# EAGLE design leanerModule (EAGLE 9.6.2)
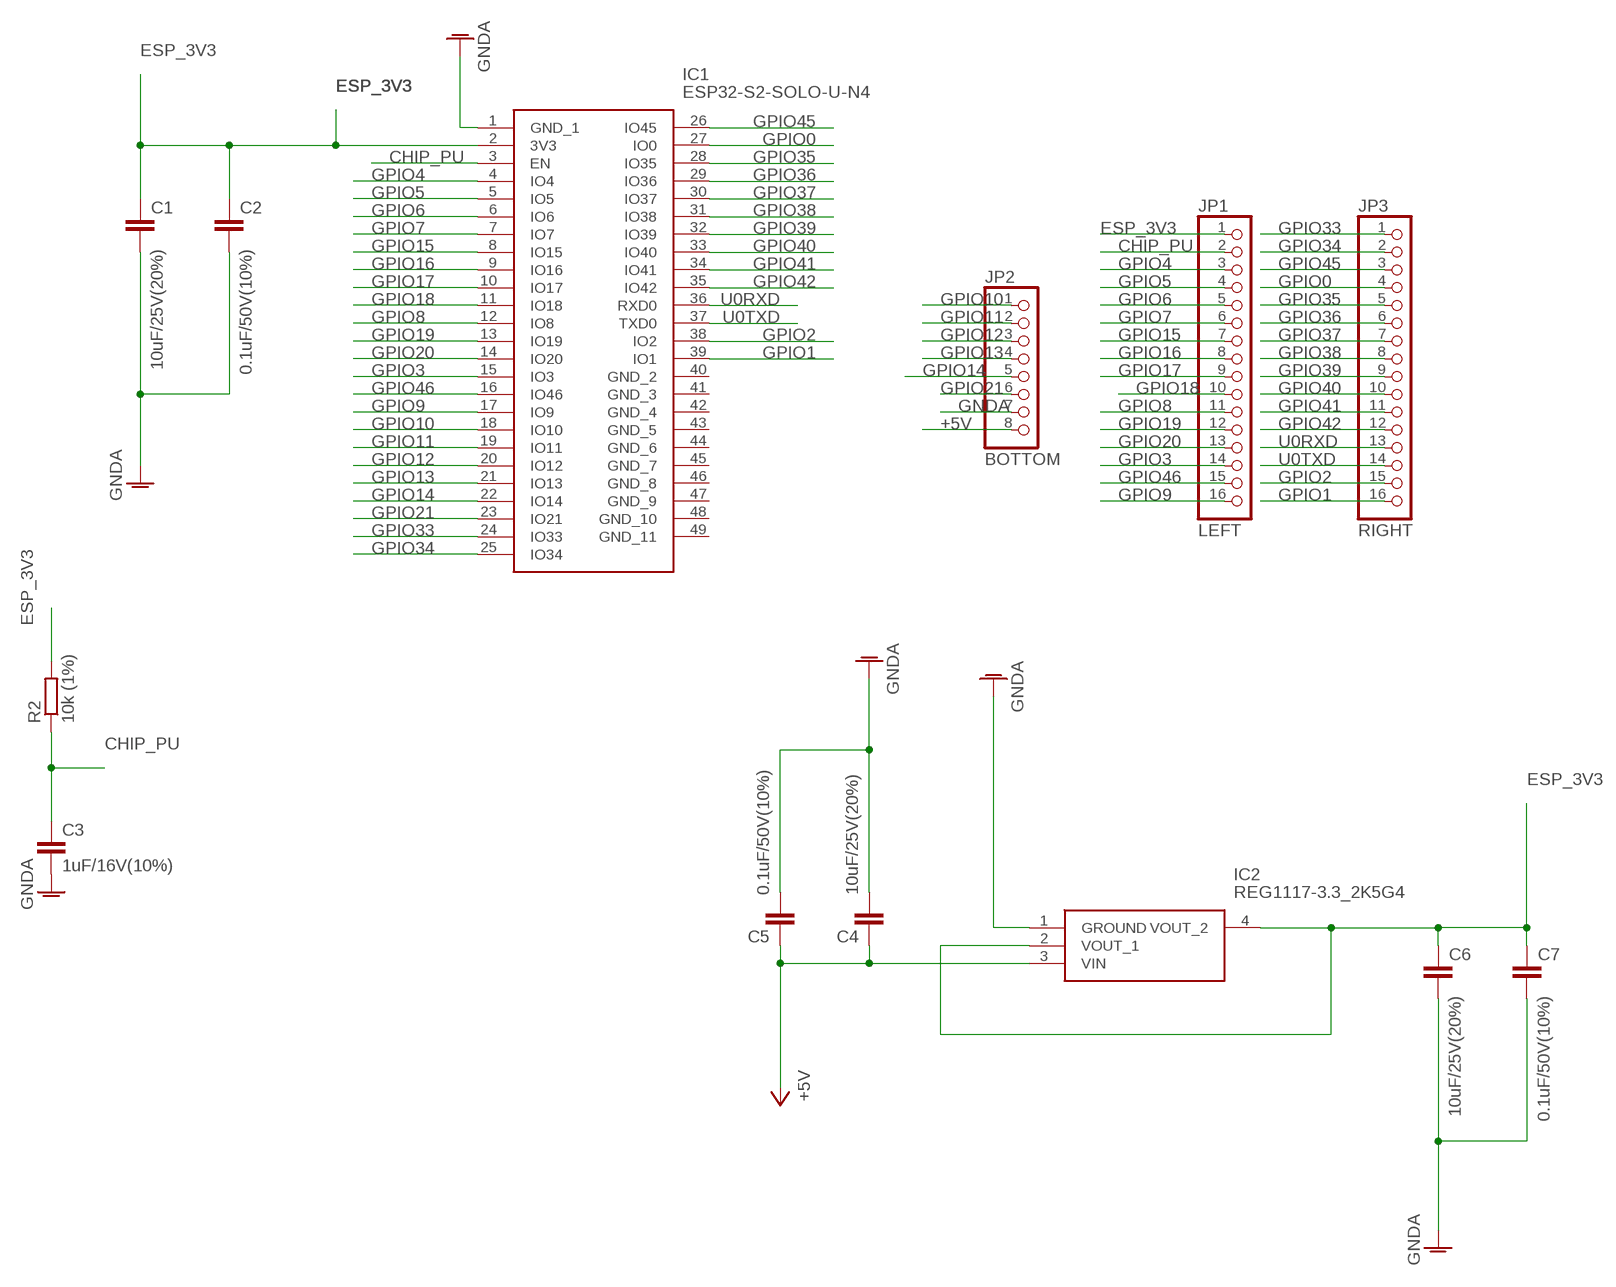
[diagram p0: schematic, sheet 1]

## Parts
C1  10uF/25V(20%)  C-EUC0805  [C0805]
C2  0.1uF/50V(10%)  C-EUC0805  [C0805]
C3  1uF/16V(10%)  C-EUC0805  [C0805]
C4  10uF/25V(20%)  C-EUC0805  [C0805]
C5  0.1uF/50V(10%)  C-EUC0805  [C0805]
C6  10uF/25V(20%)  C-EUC0805  [C0805]
C7  0.1uF/50V(10%)  C-EUC0805  [C0805]
IC1  ESP32-S2-SOLO-U-N4  [ESP32S2SOLOUN4]
IC2  REG1117-3.3_2K5G4  [SOT230P700X180-4N]
JP1  LEFT  PINHD-1X16  [1X16]
JP2  BOTTOM  PINHD-1X8  [1X08]
JP3  RIGHT  PINHD-1X16  [1X16]
R2  10k (1%)  R-EU_R0603  [R0603]

## Nets
+5V: C4.1 C5.1 IC2.3(VIN) JP2.8
CHIP_PU: C3.1 IC1.3(EN) JP1.2 R2.1
ESP_3V3: C1.1 C2.1 C6.1 C7.1 IC1.2(3V3) IC2.2(VOUT_1) IC2.4(VOUT_2) JP1.1 R2.2
GNDA: C1.2 C2.2 C3.2 C4.2 C5.2 C6.2 C7.2 IC1.1(GND_1) IC2.1(GROUND) JP2.7
GPIO0: IC1.27(IO0) JP3.4
GPIO1: IC1.39(IO1) JP3.16
GPIO2: IC1.38(IO2) JP3.15
GPIO3: IC1.15(IO3) JP1.14
GPIO4: IC1.4(IO4) JP1.3
GPIO5: IC1.5(IO5) JP1.4
GPIO6: IC1.6(IO6) JP1.5
GPIO7: IC1.7(IO7) JP1.6
GPIO8: IC1.12(IO8) JP1.11
GPIO9: IC1.17(IO9) JP1.16
GPIO10: IC1.18(IO10) JP2.1
GPIO11: IC1.19(IO11) JP2.2
GPIO12: IC1.20(IO12) JP2.3
GPIO13: IC1.21(IO13) JP2.4
GPIO14: IC1.22(IO14) JP2.5
GPIO15: IC1.8(IO15) JP1.7
GPIO16: IC1.9(IO16) JP1.8
GPIO17: IC1.10(IO17) JP1.9
GPIO18: IC1.11(IO18) JP1.10
GPIO19: IC1.13(IO19) JP1.12
GPIO20: IC1.14(IO20) JP1.13
GPIO21: IC1.23(IO21) JP2.6
GPIO33: IC1.24(IO33) JP3.1
GPIO34: IC1.25(IO34) JP3.2
GPIO35: IC1.28(IO35) JP3.5
GPIO36: IC1.29(IO36) JP3.6
GPIO37: IC1.30(IO37) JP3.7
GPIO38: IC1.31(IO38) JP3.8
GPIO39: IC1.32(IO39) JP3.9
GPIO40: IC1.33(IO40) JP3.10
GPIO41: IC1.34(IO41) JP3.11
GPIO42: IC1.35(IO42) JP3.12
GPIO45: IC1.26(IO45) JP3.3
GPIO46: IC1.16(IO46) JP1.15
U0RXD: IC1.36(RXD0) JP3.13
U0TXD: IC1.37(TXD0) JP3.14
Unconnected: IC1.40(GND_2) IC1.41(GND_3) IC1.42(GND_4) IC1.43(GND_5) IC1.44(GND_6) IC1.45(GND_7) IC1.46(GND_8) IC1.47(GND_9) IC1.48(GND_10) IC1.49(GND_11)

## Library data of the parts
C1-C7 = rcl:C-EU: CAPACITOR, European symbol; SPICEPREFIX: C
IC1 = SamacSys_Parts:ESP32-S2-SOLO-U-N4: WiFi Modules - 802.11 SMD module, ESP32-S2, 4 MB SPI flash, IPEX antenna Source: Datasheet <https://www.espressif.com/sites/default/files/documentation/esp32-s2-solo_esp32-s2-solo-u_datasheet_en.pdf>; DESCRIPTION: WiFi Modules - 802.11 SMD module, ESP32-S2, 4 MB SPI flash, IPEX antenna; HEIGHT: 3.35mm; MANUFACTURER_NAME: Espressif Systems; MANUFACTURER_PART_NUMBER: ESP32-S2-SOLO-U-N4; MOUSER_PART_NUMBER: 356-ESP32-S2-SOLOUN4; MOUSER_PRICE-STOCK: https://www.mouser.co.uk/ProductDetail/Espressif-Systems/ESP32-S2-SOLO-U-N4?qs=pBJMDPsKWf24meOzbFo%252B2g%3D%3D
IC2 = SamacSys_Parts:REG1117-3.3_2K5G4: IC REG LIN 3.3V 800MA SOT223-4 Source: Datasheet <http://www.ti.com/general/docs/suppproductinfo.tsp?distId=10&gotoUrl=http://www.ti.com/lit/gpn/reg1117>; DESCRIPTION: IC REG LIN 3.3V 800MA SOT223-4; HEIGHT: 1.8mm; MANUFACTURER_NAME: Texas Instruments; MANUFACTURER_PART_NUMBER: REG1117-3.3/2K5G4; MOUSER_PART_NUMBER: 595-REG1117332K5G4; MOUSER_PRICE-STOCK: https://www.mouser.co.uk/ProductDetail/Texas-Instruments/REG1117-33-2K5G4?qs=quKhnJqH4FhleN2uSMVs0w%3D%3D
JP1 JP3 = pinhead:PINHD-1X16: PIN HEADER
JP2 = pinhead:PINHD-1X8: PIN HEADER
R2 = rcl:R-EU_: RESISTOR, European symbol; SPICEPREFIX: R

## Board
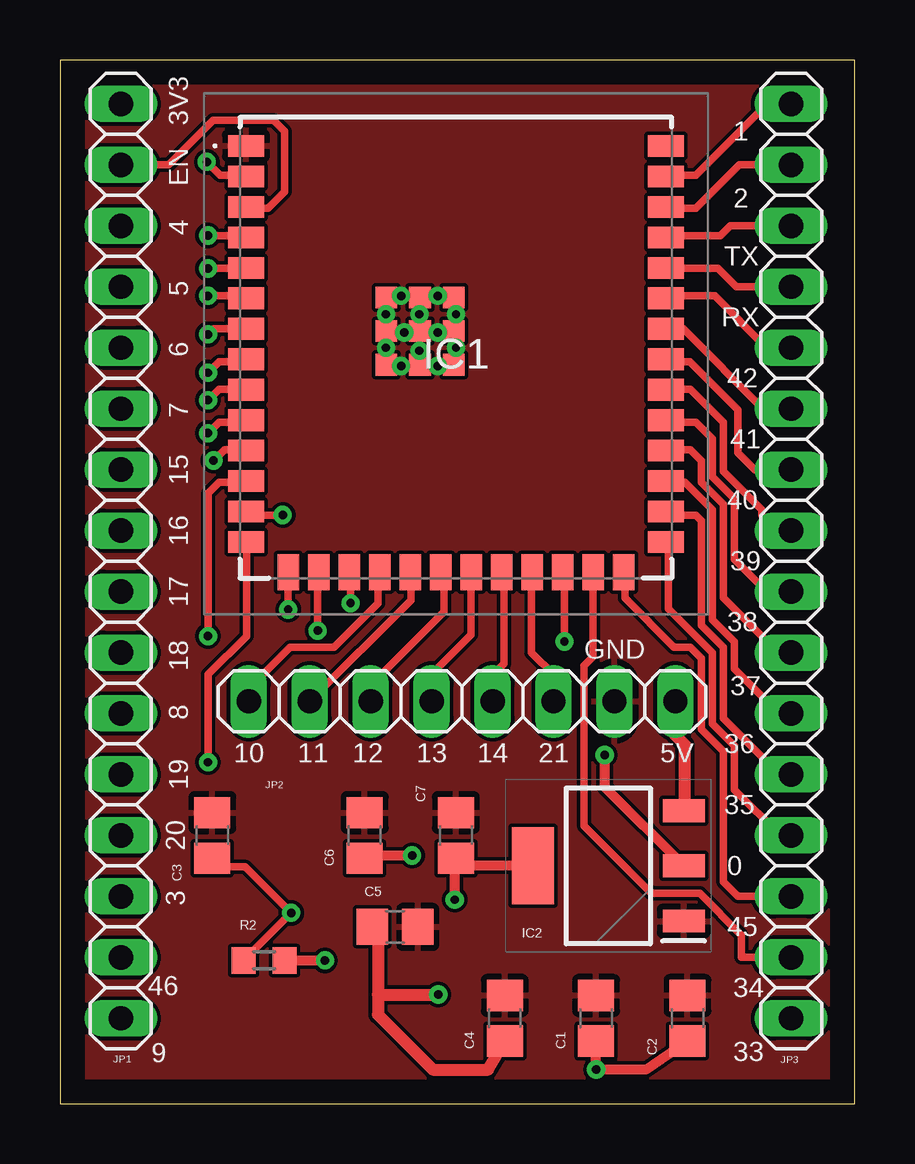
[diagram p1: board, top side]
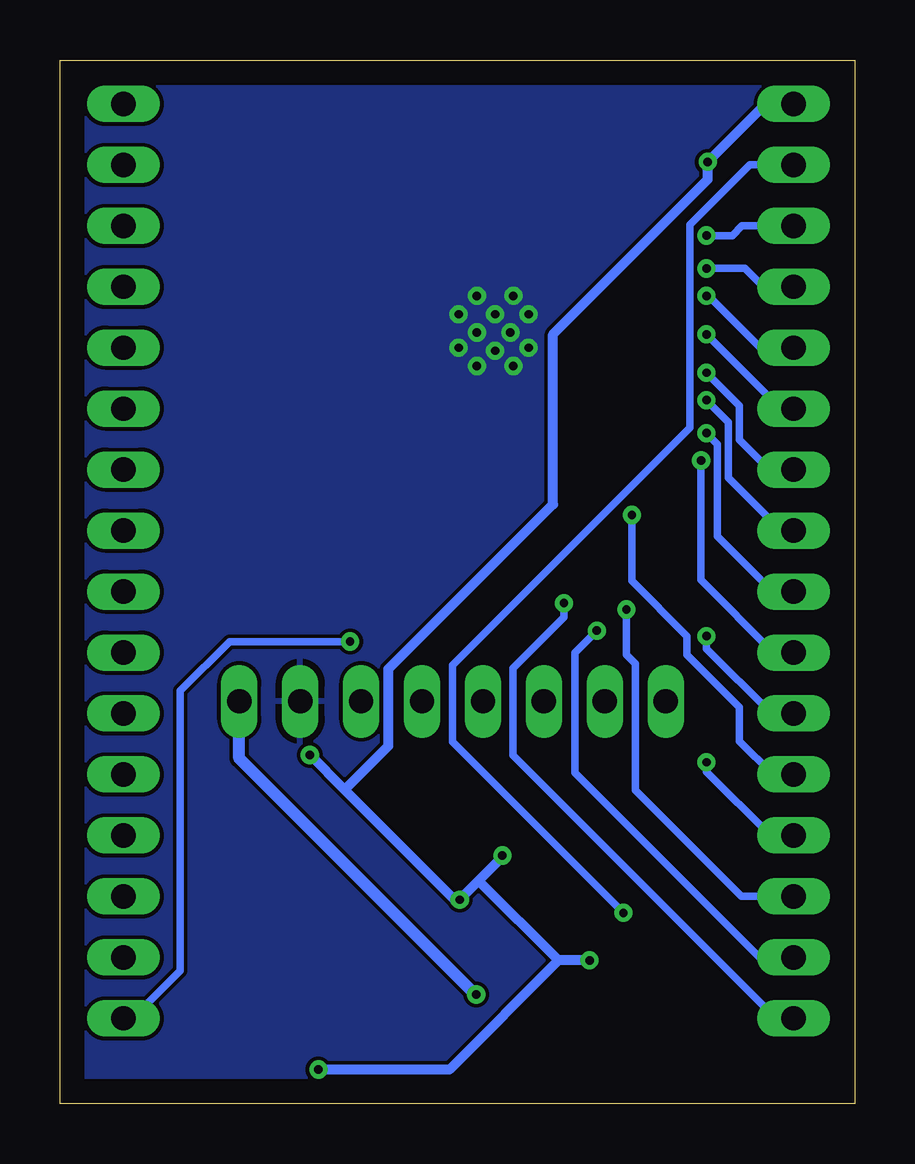
[diagram p2: board, bottom side, seen from below]

Size 33.13 x 43.48 mm. Coordinates in mm from the lower left corner, seen from the top.
Outline: 0,0 33.13,0 33.13,43.48 0,43.48 0,0
Copper layers (1*16): Top 0.035mm / dielectric 1.5mm / Bottom 0.035mm
Design rules "default *": minimum track width 12mil, minimum drill 0.35mm, track to track 6mil, track to pad 6mil, pad to pad 6mil, via to via 6mil, smd to smd 6mil, copper to edge 40mil, drill to drill 6mil, minimum pad ring 10mil, minimum via ring 8mil, stop-mask expansion 4mil, vias tented up to drill 0mil, thermal gap 10mil

### Footprints (pad centres in the part's own frame; a part is rotated, then mirrored left to right if it is on the bottom)
C0805 = smd 1.3 x 1.5: 1 -0.95,0; 2 0.95,0
ESP32S2SOLOUN4 = smd 1.5 x 0.9: 1 -8.75,8.41; 2 -8.75,7.14; 3 -8.75,5.87; 4 -8.75,4.6; 5 -8.75,3.33; 6 -8.75,2.06; 7 -8.75,0.79; 8 -8.75,-0.48; 9 -8.75,-1.75; 10 -8.75,-3.02; 11 -8.75,-4.29; 12 -8.75,-5.56; 13 -8.75,-6.83; 14 -8.75,-8.1; 27 8.75,-8.1; 28 8.75,-6.83; 29 8.75,-5.56; 30 8.75,-4.29; 31 8.75,-3.02; 32 8.75,-1.75; 33 8.75,-0.48; 34 8.75,0.79; 35 8.75,2.06; 36 8.75,3.33; 37 8.75,4.6; 38 8.75,5.87; 39 8.75,7.14; 40 8.75,8.41 | smd 0.9 x 1.5: 15 -6.985,-9.35; 16 -5.715,-9.35; 17 -4.445,-9.35; 18 -3.175,-9.35; 19 -1.905,-9.35; 20 -0.635,-9.35; 21 0.635,-9.35; 22 1.905,-9.35; 23 3.175,-9.35; 24 4.445,-9.35; 25 5.715,-9.35; 26 6.985,-9.35 | smd 0.9 x 0.9: 41 -1.5,0.69; 42 -1.5,2.09; 43 -2.9,2.09; 44 -2.9,0.69; 45 -2.9,-0.71; 46 -1.5,-0.71; 47 -0.1,-0.71; 48 -0.1,0.69; 49 -0.1,2.09
SOT230P700X180-4N = smd 1.75 x 0.95: 1 -3.15,2.3; 2 -3.15,0; 3 -3.15,-2.3 | smd 1.75 x 3.2: 4 3.15,0
1X16 = drill 1.016 long: 1 -19.05,0; 2 -16.51,0; 3 -13.97,0; 4 -11.43,0; 5 -8.89,0; 6 -6.35,0; 7 -3.81,0; 8 -1.27,0; 9 1.27,0; 10 3.81,0; 11 6.35,0; 12 8.89,0; 13 11.43,0; 14 13.97,0; 15 16.51,0; 16 19.05,0
1X08 = drill 1.016 long: 1 -8.89,0; 2 -6.35,0; 3 -3.81,0; 4 -1.27,0; 5 1.27,0; 6 3.81,0; 7 6.35,0; 8 8.89,0
R0603 = smd 1 x 1.1: 1 -0.85,0; 2 0.85,0

### Placement (x,y rotation side)
C1  22.35,3.56 90 top
C2  26.16,3.56 90 top
C3  6.35,11.18 90 top
C4  18.54,3.56 90 top
C5  13.97,7.37 0 top
C6  12.7,11.18 90 top
C7  16.51,11.18 90 top
IC1  16.51,31.5 0 top
IC2  22.86,9.91 180 top
JP1  2.54,22.61 270 top
JP2  16.76,16.76 0 top
JP3  30.48,22.61 90 top
R2  8.51,5.97 0 top

### Tracks (layer width: path | path; a pad name or v marks a point on that pad's centre or on a via)
+5V  (via drill 0.35)
  Top 0.305: IC2.3 26.06,12.39 | 13.26,7.14 C5.1
  Top 0.508: 13.26,7.14 13.26,4.55 | 13.26,4.55 13.26,3.71 15.54,1.42 17.85,1.42 C4.1 | 13.26,4.55 v15.77,4.55 | 26.06,12.39 26.06,14.95 25.65,15.35 JP2.8
  Bottom 0.508: v15.77,4.55 15.81,4.55 25.65,14.39 JP2.8
CHIP_PU  (via drill 0.35)
  Top 0.305: C3.1 6.4,10.11 6.63,9.88 7.71,9.88 v9.64,7.95 R2.1 | JP1.2 4.52,39.12 6.38,40.97 8.91,40.97 9.37,40.51 9.37,38 8.69,37.31 7.77,37.31 IC1.3
  Bottom 0.305: v9.64,7.95 16.76,15.07 16.76,18.26 6.86,28.17 6.86,36.63 4.37,39.12 JP1.2
ESP_3V3  (via drill 0.35)
  Top 0.305: v6.12,39.24 6.68,38.68 7.54,38.68 IC1.2 | 12.8,10.34 C6.1
  Top 0.406: C2.1 24.42,1.42 v22.35,1.42 C1.1 | v14.68,10.34 12.8,10.34 | v22.71,14.53 22.71,13.21 IC2.2 | R2.2 v11.05,5.97 | IC2.4 16.83,9.91 C7.1 16.46,10.18 v16.46,8.5
  Bottom 0.406: JP1.1 3.71,41.66 v6.12,39.24 6.12,38.51 12.57,32.05 12.57,24.97 19.43,18.11 19.43,14.91 21.26,13.08 | v14.68,10.34 14.68,10.29 15.67,9.3 | 15.67,9.3 16.46,8.51 v16.46,8.5 16.68,8.5 21.26,13.08 | 21.26,13.08 v22.71,14.53 | v22.35,1.42 16.89,1.42 12.34,5.97 | 15.67,9.3 12.34,5.97 | v11.05,5.97 12.34,5.97
GNDA  (via drill 0.35)
  Top 0.305: 12.57,12.17 C6.2 12.8,12.17 | 15.09,7.37 C5.2
  other vias: 14.22,33.66 15.75,33.66 13.59,32.89 13.59,31.5 14.22,30.73 14.35,32.13 14.99,31.37 15.75,30.73 16.51,31.5 15.75,32.13 14.99,32.89 16.51,32.89
  pour Bottom: 0,45.47 33.02,45.47 33.02,-1.52 0,-1.52
  pour Top: 0,45.47 34.29,45.47 34.29,-1.52 0,-1.52
GPIO0
  Top 0.305: IC1.27 25.38,23.37 25.38,20.62 27.2,18.8 27.2,15.82 28.12,14.91 28.12,13.08 30.02,11.18 JP3.4
GPIO1
  Top 0.305: JP3.16 29.49,41.66 26.52,38.68 25.38,38.68 IC1.39
GPIO2
  Top 0.305: IC1.38 25.38,37.31 26.52,37.31 28.32,39.12 JP3.15
GPIO3  (via drill 0.35)
  Top 0.305: v9.51,20.59 9.51,22.13 IC1.15
  Bottom 0.305: v9.51,20.59 9.51,18.71 9.14,18.34 9.14,13.06 4.72,8.64 JP1.14
GPIO4  (via drill 0.35)
  Top 0.305: v6.17,36.17 7.54,36.17 IC1.4
  Bottom 0.305: JP1.3 4.7,36.58 5.11,36.17 v6.17,36.17
GPIO5  (via drill 0.35)
  Top 0.305: v6.17,34.8 7.54,34.8 IC1.5
  Bottom 0.305: v6.17,34.8 4.57,34.8 3.81,34.04 JP1.4
GPIO6  (via drill 0.35)
  Top 0.305: v6.17,33.66 7.54,33.66 IC1.6
  Bottom 0.305: v6.17,33.66 6.1,33.66 3.94,31.5 JP1.5
GPIO7  (via drill 0.35)
  Top 0.305: v6.17,32.05 6.4,32.28 7.54,32.28 IC1.7
  Bottom 0.305: v6.17,32.05 3.07,28.96 JP1.6
GPIO8  (via drill 0.35)
  Top 0.305: v6.17,19.48 6.17,25.43 6.63,25.88 7.54,25.88 IC1.12
  Bottom 0.305: v6.17,19.48 6.17,18.96 3.47,16.26 JP1.11
GPIO9  (via drill 0.35)
  Top 0.305: v12.12,20.85 12.12,22 IC1.17
  Bottom 0.305: v12.12,20.85 12.12,20.27 14.25,18.14 14.25,14.52 3.29,3.56 JP1.16
GPIO10
  Top 0.305: IC1.18 13.26,22 13.26,20.85 11.43,19.02 9.6,19.02 8,17.42 8,16.97 JP2.1
GPIO11
  Top 0.305: JP2.2 14.63,20.98 14.63,22 IC1.19
GPIO12
  Top 0.305: IC1.20 16,22 16,20.48 12.95,17.44 JP2.3
GPIO13
  Top 0.305: IC1.21 17.14,19.55 15.49,17.89 JP2.4
GPIO14
  Top 0.305: IC1.22 18.52,22 18.52,18.34 18.06,17.88 18.06,16.97 JP2.5
GPIO15  (via drill 0.35)
  Top 0.305: v6.17,30.45 6.63,30.91 7.54,30.91 IC1.8
  Bottom 0.305: v6.17,30.45 4.8,29.08 4.8,27.66 3.55,26.41 3.55,26.42 JP1.7
GPIO16  (via drill 0.35)
  Top 0.305: v6.17,29.31 6.63,29.77 7.54,29.77 IC1.9
  Bottom 0.305: v6.17,29.31 5.26,28.4 5.26,26.07 3.06,23.88 JP1.8
GPIO17  (via drill 0.35)
  Top 0.305: v6.17,27.94 6.63,28.4 7.54,28.4 IC1.10
  Bottom 0.305: v6.17,27.94 5.71,27.48 5.71,23.65 3.4,21.34 JP1.9
GPIO18  (via drill 0.35)
  Top 0.305: v6.4,26.8 6.86,27.25 7.54,27.25 IC1.11
  Bottom 0.305: v6.4,26.8 6.4,21.82 3.38,18.8 JP1.10
GPIO19  (via drill 0.35)
  Top 0.305: v9.28,24.52 9.27,24.51 7.77,24.51 IC1.13
  Bottom 0.305: v9.28,24.52 9.28,21.78 6.99,19.48 6.99,18.69 4.8,16.51 4.8,15.1 3.42,13.72 JP1.12
GPIO20  (via drill 0.35)
  Top 0.305: v6.17,14.22 6.17,17.88 7.77,19.48 7.77,23.37 IC1.14
  Bottom 0.305: v6.17,14.22 6.17,13.83 3.52,11.18 JP1.13
GPIO21
  Top 0.305: JP2.6 20.57,17.88 19.66,18.8 19.66,22 IC1.23
GPIO33  (via drill 0.35)
  Top 0.305: v21.03,19.25 21.03,22 IC1.24
  Bottom 0.305: v21.03,19.25 26.06,19.25 28.12,17.2 28.12,5.54 30.1,3.56 JP3.1
GPIO34
  Top 0.305: IC1.25 22.23,18.62 21.84,18.24 21.84,11.58 24.66,8.77 26.67,8.77 28.41,7.03 28.41,6.1 JP3.2
GPIO35
  Top 0.305: IC1.28 25.38,24.51 26.52,24.51 26.75,24.28 26.75,19.94 27.66,19.02 27.66,16.05 30,13.72 JP3.5
GPIO36
  Top 0.305: IC1.29 25.38,25.88 26.06,25.88 27.2,24.74 27.2,20.17 28.12,19.25 28.12,18.11 29.97,16.26 JP3.6
GPIO37
  Top 0.305: JP3.7 29.95,18.8 27.66,21.08 27.66,24.97 26.75,25.88 26.75,26.8 26.29,27.25 25.38,27.25 IC1.30
GPIO38
  Top 0.305: IC1.31 25.38,28.4 26.52,28.4 27.2,27.71 27.2,26.11 28.12,25.2 28.12,22.68 29.46,21.34 JP3.8
GPIO39
  Top 0.305: IC1.32 25.38,29.77 26.29,29.77 27.66,28.4 27.66,26.34 29.26,24.74 29.26,24.51 29.72,24.05 30.4,24.05 JP3.9
GPIO40
  Top 0.305: IC1.33 25.38,30.91 26.26,30.91 28.27,28.91 28.27,27.12 28.97,26.42 JP3.10
GPIO41
  Top 0.305: IC1.34 25.38,32.28 25.98,32.28 29.31,28.96 JP3.11
GPIO42
  Top 0.305: IC1.35 25.38,33.66 27.29,33.66 29.45,31.5 JP3.12
GPIO45
  Top 0.305: IC1.26 23.55,22 23.55,21.08 25.6,19.02 26.29,19.02 26.75,18.57 26.75,15.6 27.66,14.68 27.66,9.25 28.27,8.64 JP3.3
GPIO46  (via drill 0.35)
  Top 0.305: v10.74,19.71 10.74,22 IC1.16
  Bottom 0.305: v10.74,19.71 11.66,18.8 11.66,13.79 3.96,6.1 JP1.15
U0RXD
  Top 0.305: IC1.36 25.38,34.8 27.43,34.8 28.19,34.04 JP3.13
U0TXD
  Top 0.305: IC1.37 25.38,36.17 27.53,36.17 27.94,36.58 JP3.14

### Text on the board
tPlace: 3V3 | 1 | EN | 2 | 4 | TX | 5 | RX | 6 | 42 | 7 | 41 | 15 | 40 | 16 | 39 | 17 | 38 | GND | 18 | 37 | 8 | 36 | 10 | 11 | 12 | 13 | 14 | 21 | 5V | 19 | 35 | 20 | 0 | 3 | 45 | 46 | 34 | 9 | 33